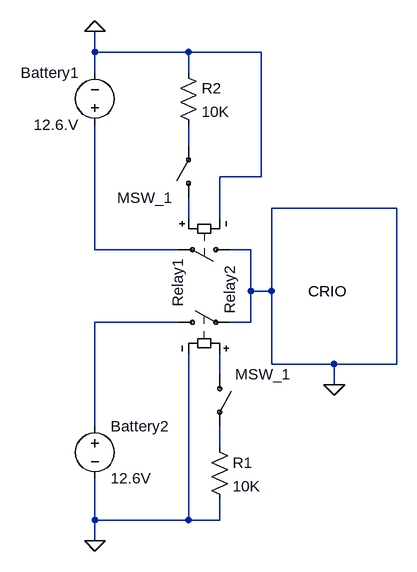
[diagram p0: schematic CRIOSystem.asc]
CRIOSystem.asc, the LTspice schematic file:
Version 4
SHEET 1 884 680
WIRE -48 -528 -48 -560
WIRE 96 -528 -48 -528
WIRE 208 -528 96 -528
WIRE -48 -496 -48 -528
WIRE 96 -496 96 -528
WIRE 96 -384 96 -416
WIRE 208 -336 208 -528
WIRE 208 -336 144 -336
WIRE 416 -288 224 -288
WIRE 96 -272 96 -304
WIRE 144 -272 144 -336
WIRE -48 -224 -48 -416
WIRE 80 -224 -48 -224
WIRE 192 -224 160 -224
WIRE 192 -160 192 -224
WIRE 224 -160 224 -288
WIRE 224 -160 192 -160
WIRE 80 -112 -48 -112
WIRE 192 -112 192 -160
WIRE 192 -112 160 -112
WIRE 224 -48 224 -160
WIRE 320 -48 224 -48
WIRE 416 -48 416 -288
WIRE 416 -48 320 -48
WIRE 144 -32 144 -64
WIRE 320 -16 320 -48
WIRE -48 48 -48 -112
WIRE 144 80 144 48
WIRE -48 192 -48 128
WIRE 96 192 96 -64
WIRE 96 192 -48 192
WIRE 144 192 144 160
WIRE 144 192 96 192
WIRE -48 224 -48 192
FLAG -48 224 0
FLAG -48 -560 0
FLAG 320 -16 0
SYMBOL voltage -48 -400 R180
WINDOW 0 24 96 Left 2
WINDOW 3 24 16 Left 2
SYMATTR InstName Battery1
SYMATTR Value 12.6.V
SYMBOL voltage -48 32 R0
SYMATTR InstName Battery2
SYMATTR Value 12.6V
SYMBOL sw 64 -112 R270
SYMATTR InstName Relay1
SYMATTR Value ""
SYMBOL sw 176 -224 R90
SYMATTR InstName Relay2
SYMATTR Value ""
SYMBOL res 128 64 R0
SYMATTR InstName R1
SYMATTR Value 10K
SYMBOL res 80 -512 R0
SYMATTR InstName R2
SYMATTR Value 10K
SYMBOL csw 144 -32 R0
SYMATTR InstName MSW_1
SYMATTR Value ""
SYMBOL csw 96 -304 R180
WINDOW 3 24 -21 Left 2
SYMATTR Value ""
SYMATTR InstName MSW_1
TEXT 280 -160 Left 2 !CRIO

The netlist it stands for:
* CRIOSystem.asc
V§Battery1 N003 0 12.6.V
V§Battery2 N004 0 12.6V
S§Relay1 N004 0 N005 0
S§Relay2 0 N003 N002 0
R1 N006 0 10K
R2 0 N001 10K
W§MSW_1 N005 N006
W§MSW_1 N002 N001
CRIO
.backanno
.end